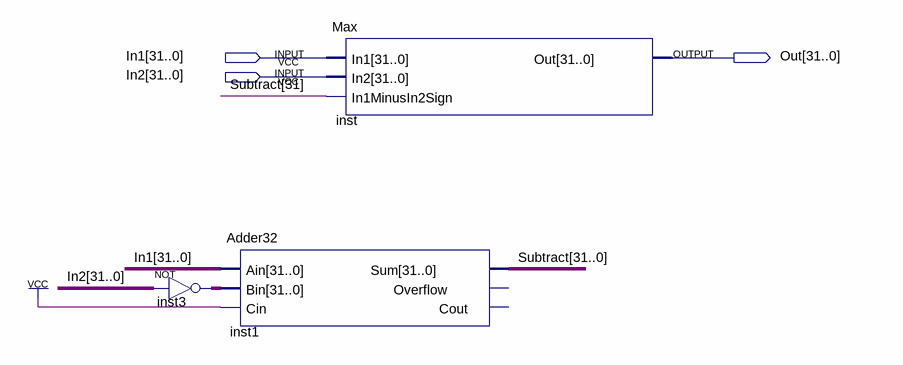
[diagram p0: schematic sheet]
// Quartus schematic MaxTest.bdf as structural Verilog: 3 symbols, 3 pins
module MaxTest (
  input  [31:0] In1,
  input  [31:0] In2,
  output [31:0] Out
);

  wire [31:0] inst3_out, Subtract;

  assign inst3_out = ~In2;  // NOT inst3, 32 bits wide
  Adder32 inst1 (.Ain(In1), .Bin(inst3_out), .Cin(1'b1), .Sum(Subtract));  // open: Overflow, Cout
  Max inst (.In1(In1), .In2(In2), .In1MinusIn2Sign(Subtract[31]), .Out(Out));
endmodule
